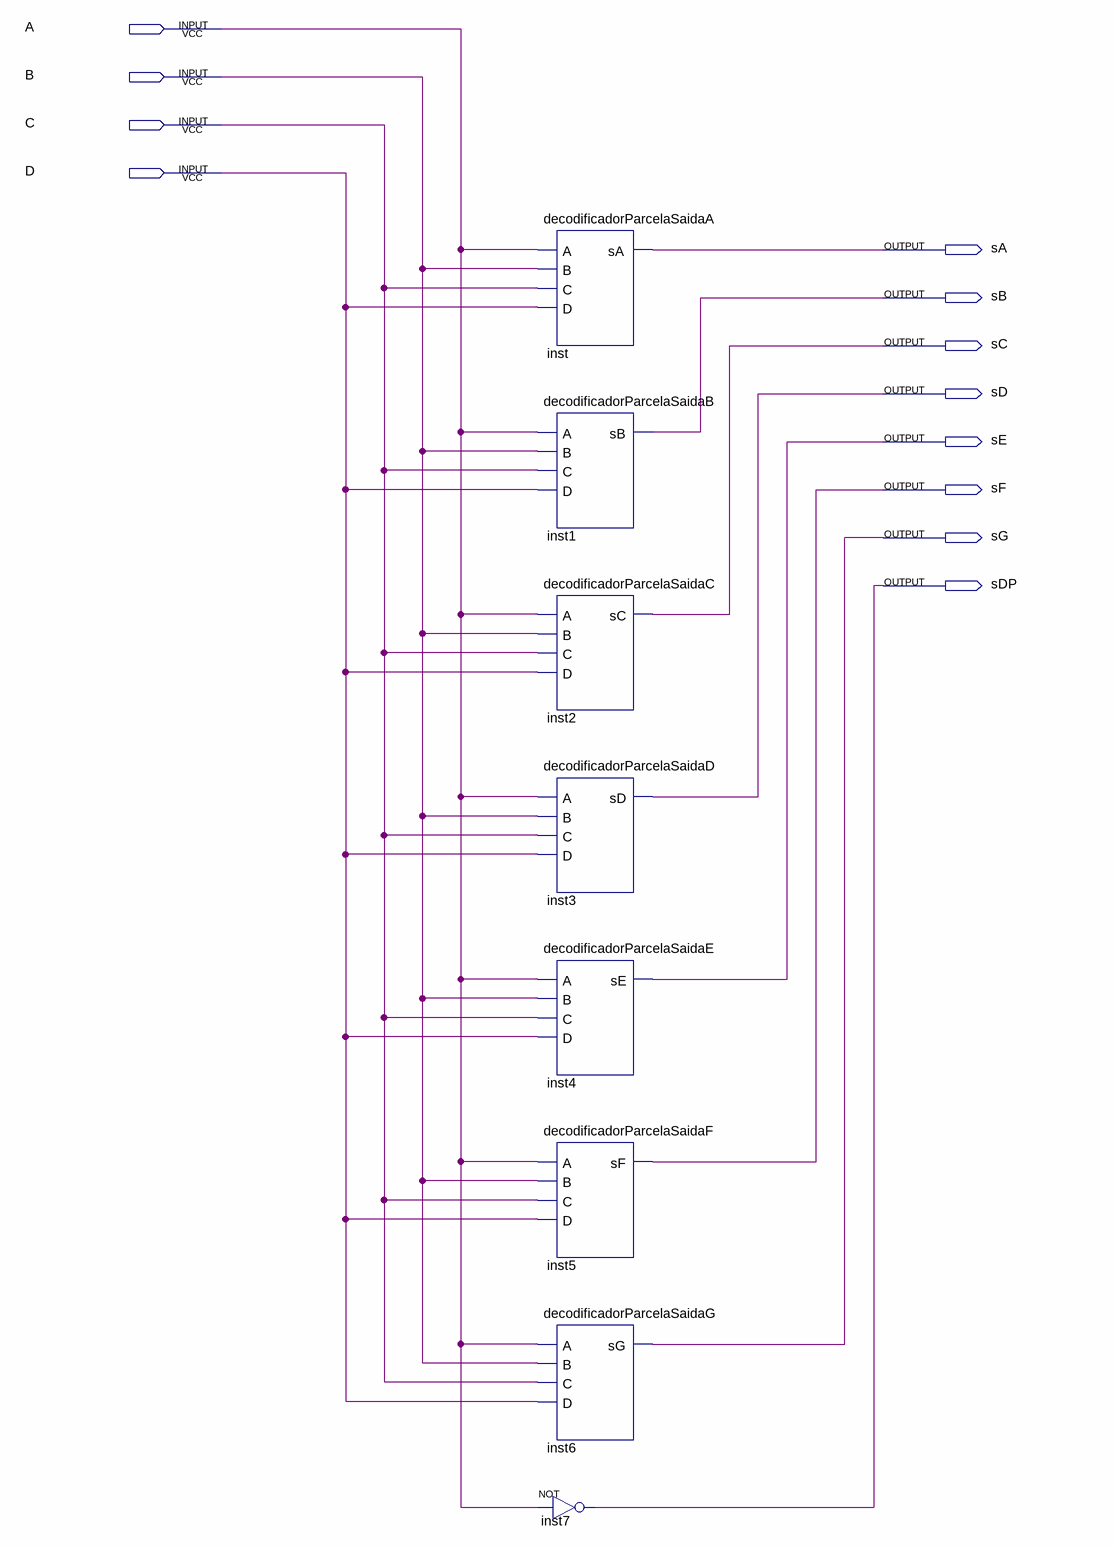
[diagram p0: schematic sheet]
// Quartus schematic decodificadorParcela.bdf as structural Verilog: 8 symbols, 12 pins
module decodificadorParcela (
  input  A,
  input  B,
  input  C,
  input  D,
  output sA,
  output sB,
  output sC,
  output sD,
  output sE,
  output sF,
  output sG,
  output sDP
);

  decodificadorParcelaSaidaA inst (.A(A), .B(B), .C(C), .D(D), .sA(sA));
  decodificadorParcelaSaidaB inst1 (.A(A), .B(B), .C(C), .D(D), .sB(sB));
  decodificadorParcelaSaidaC inst2 (.A(A), .B(B), .C(C), .D(D), .sC(sC));
  decodificadorParcelaSaidaD inst3 (.A(A), .B(B), .C(C), .D(D), .sD(sD));
  decodificadorParcelaSaidaE inst4 (.A(A), .B(B), .C(C), .D(D), .sE(sE));
  decodificadorParcelaSaidaF inst5 (.A(A), .B(B), .C(C), .D(D), .sF(sF));
  decodificadorParcelaSaidaG inst6 (.A(A), .B(B), .C(C), .D(D), .sG(sG));
  not inst7 (sDP, A);
endmodule
